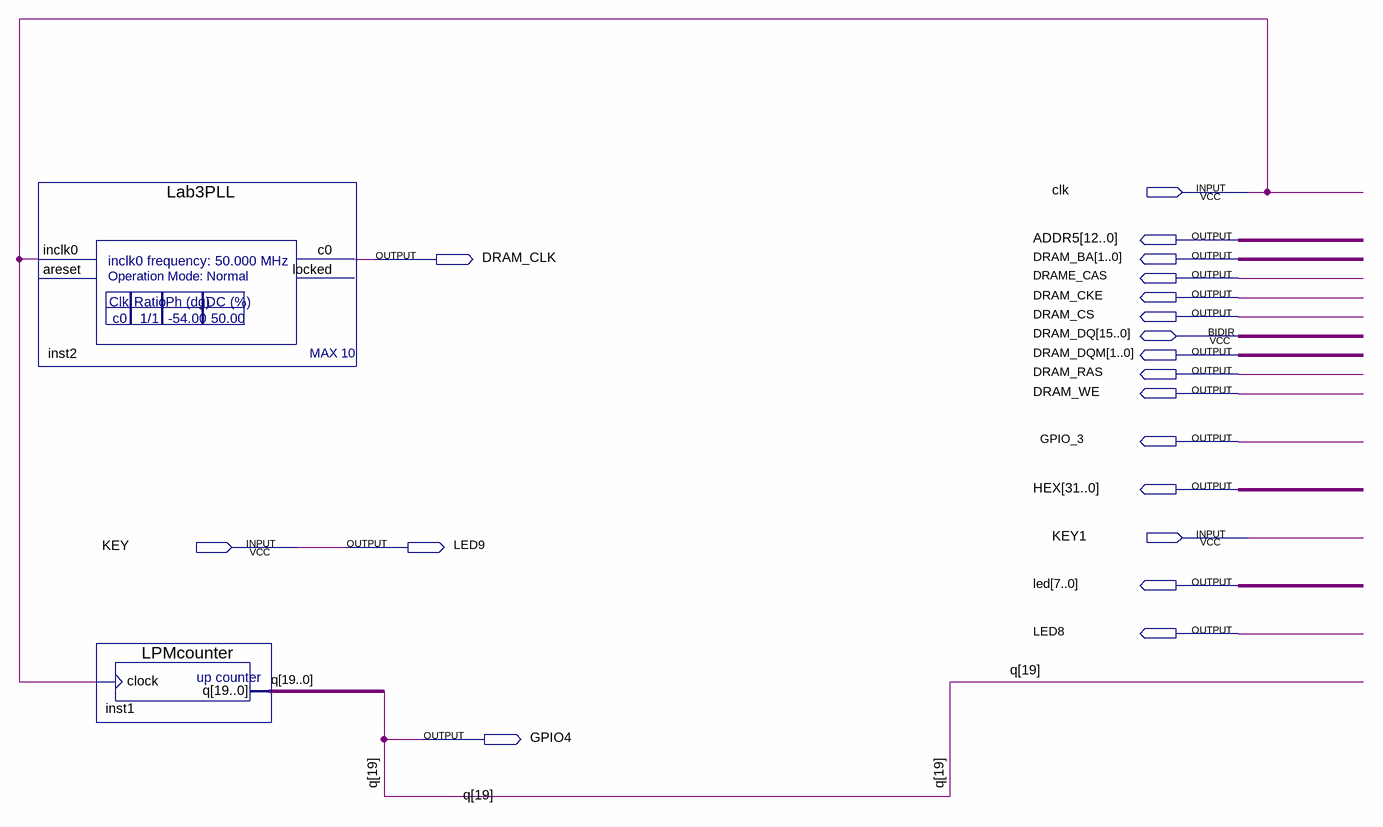
[diagram p0: schematic sheet]
// Quartus schematic Lab3.bdf as structural Verilog: 2 symbols, 19 pins
module Lab3 (
  input  clk,
  input  KEY1,
  input  KEY,
  inout  [15:0] DRAM_DQ,
  output [12:0] ADDR5,
  output DRAM_CLK,
  output [1:0] DRAM_BA,
  output DRAME_CAS,
  output DRAM_CKE,
  output DRAM_CS,
  output [1:0] DRAM_DQM,
  output DRAM_RAS,
  output DRAM_WE,
  output GPIO_3,
  output [31:0] HEX,
  output LED9,
  output [7:0] led,
  output LED8,
  output GPIO4
);

  wire [18:0] q;

  Lab3PLL inst2 (.inclk0(clk), .c0(DRAM_CLK));  // open: areset, locked
  LPMcounter inst1 (.clock(clk), .q({GPIO4, q}));

  assign LED9 = KEY;

  // Other names for the same wires on the sheet: q[19] = GPIO4
endmodule
